# Altium schematic sheet RTM_CON.SchDoc: Sayma RTM
size 420 x 297 mm; Author: G.Kasprowicz; CompanyName: WUT ISE; DrawnBy: G.Kasprowicz; Organization: WUT ISE; Address1: PW ISE; Address2: Nowowiejska 15/19 00-665 Warsaw; Address3: gkasprow@gmail.com; DocumentNumber: 2; Revision: 1.0; SheetNumber: 2; SheetTotal: 18; ModifiedBy: -; CheckedDate: -; Title2: RTM connector; DivGrp: WUT ISE; Designer: G.Kasprowicz; ModifiedDate: -; ProjectName: Sensor Box
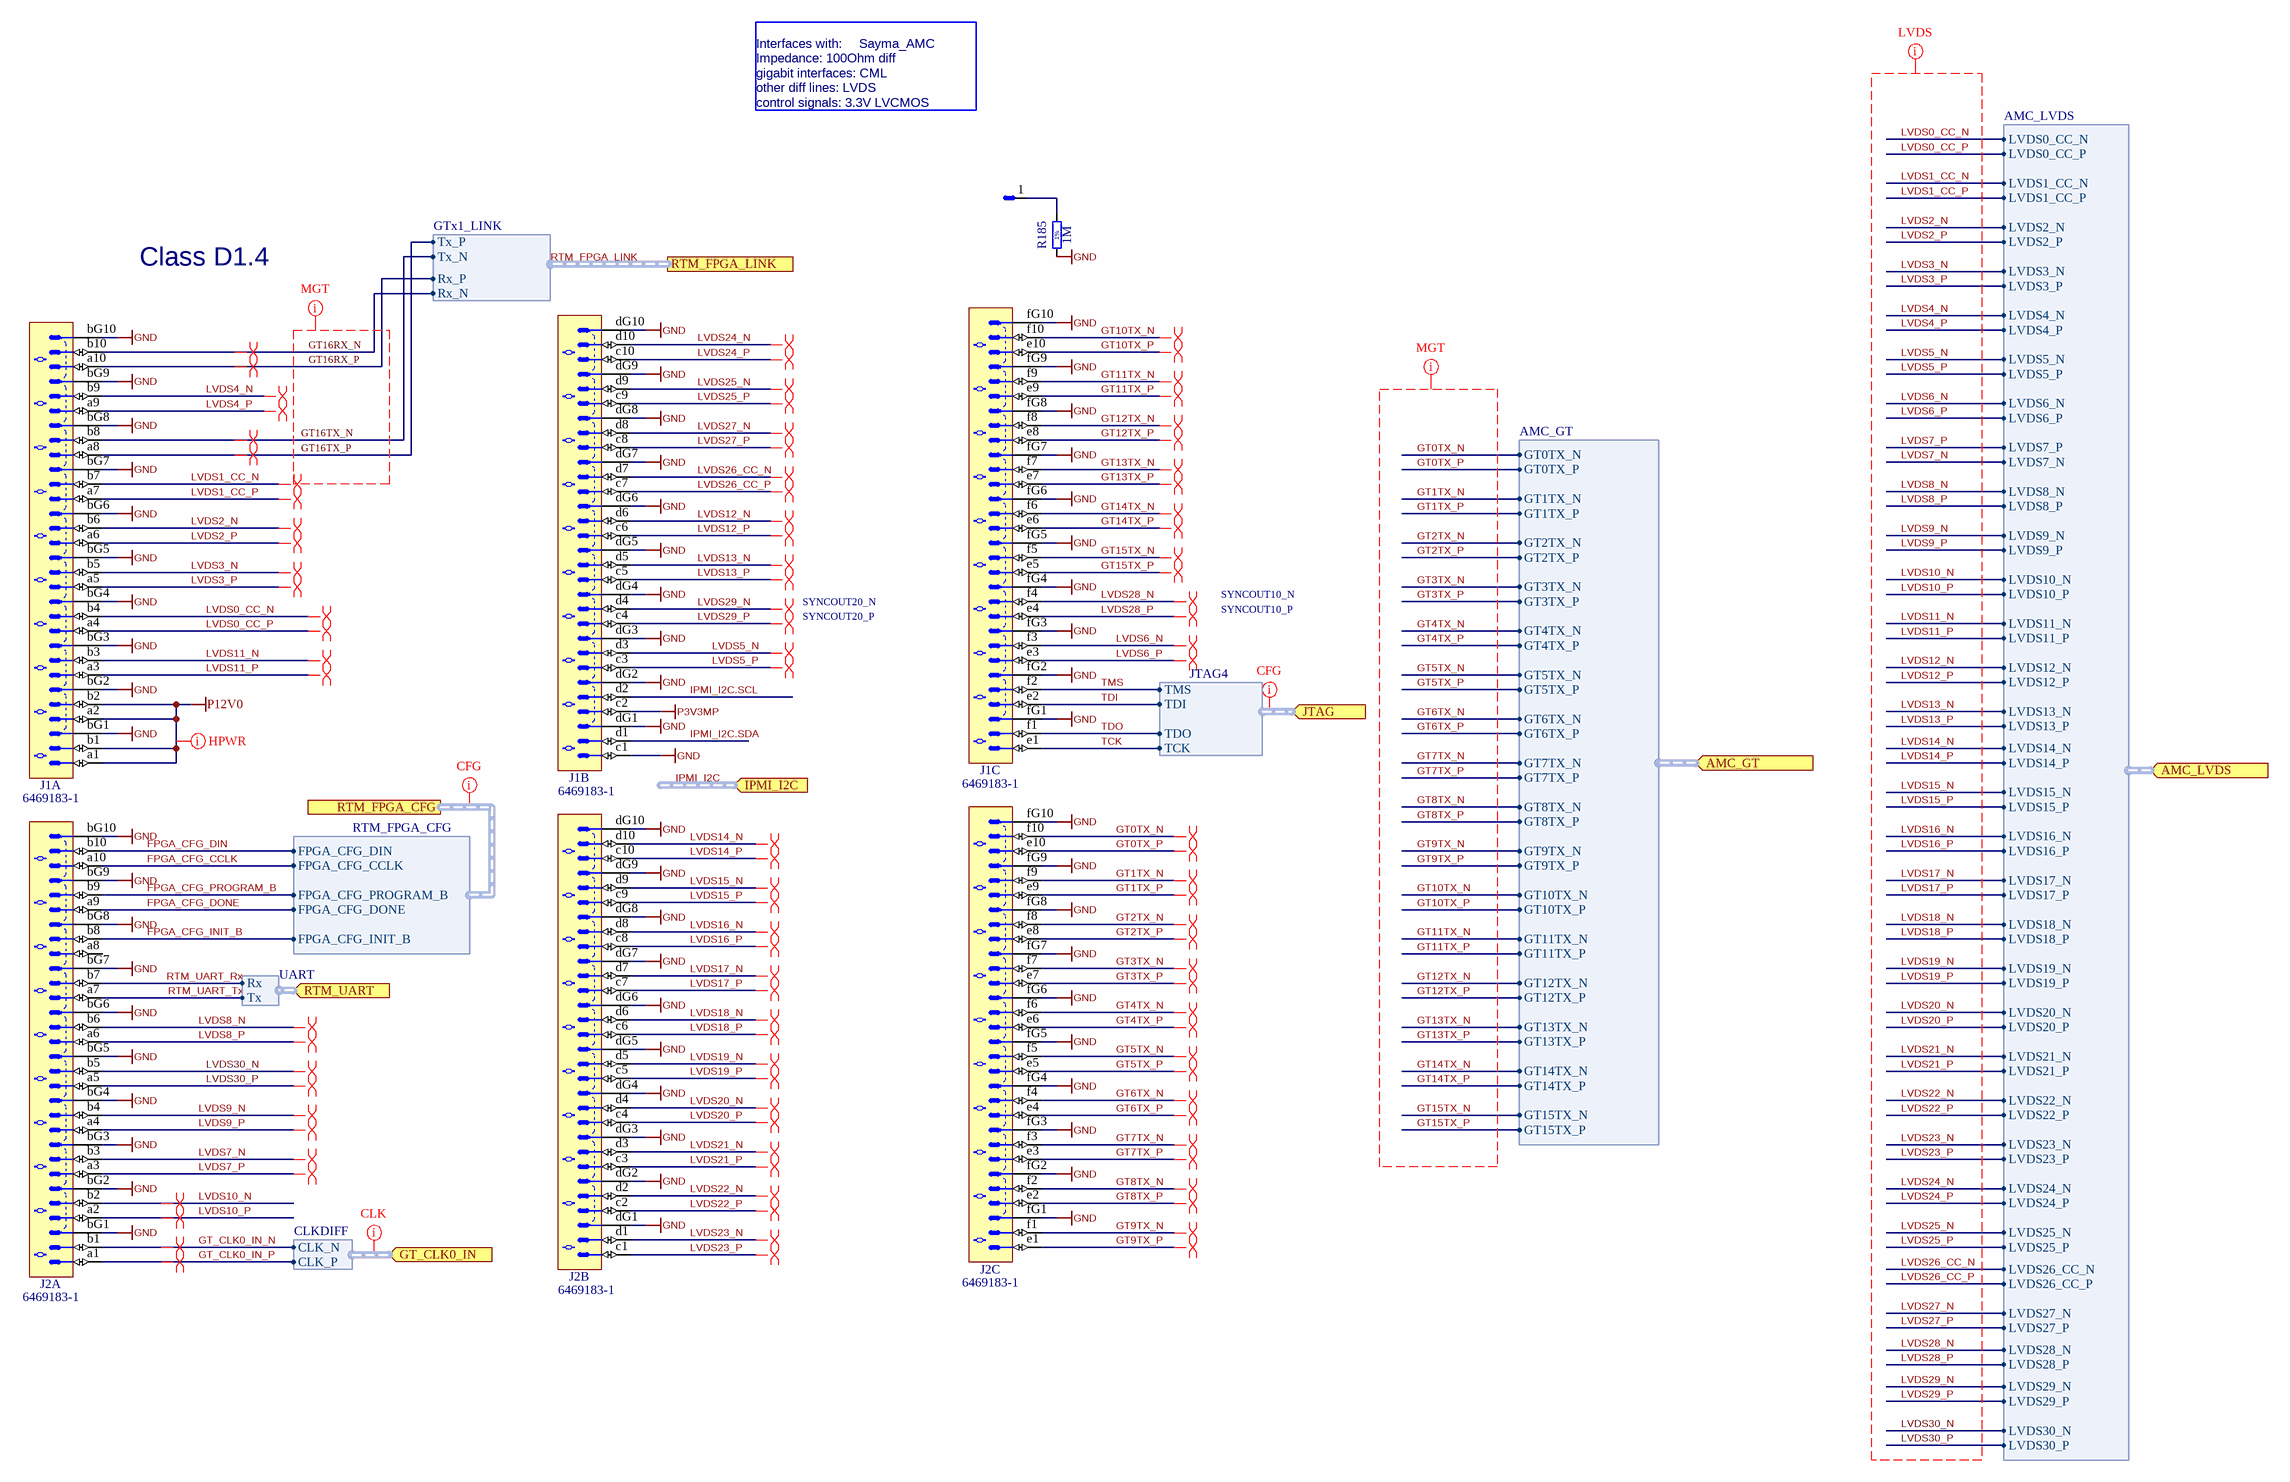
[diagram p0: RTM_CON.SchDoc]

## Parts
J1  Manufacturer Part Number: 6469183-1  [TYCO_6469183-1]  (hidden comment: Advanced TCA)  (parts A,B,C of 3)
J2  Manufacturer Part Number: 6469183-1  [TYCO_6469183-1]  (hidden comment: Advanced TCA)  (parts A,B,C of 3)
J3  (no value)  [TYCO_1469265-1]
R185  1M  [RESC5025X65N]

## Ports
AMC_GT (in, harness AMC_GT), AMC_LVDS (in, harness AMC_LVDS), GT_CLK0_IN (in, harness CLKDIFF), IPMI_I2C (in, harness I2C), JTAG (in, harness JTAG4), RTM_FPGA_CFG (harness RTM_FPGA_CFG), RTM_FPGA_LINK (harness GTx1_LINK), RTM_UART (in, harness UART)

## Harnesses
UART: Rx, Tx
JTAG4: TCK, TDI, TDO, TMS
RTM_FPGA_CFG: FPGA_CFG_DIN, FPGA_CFG_CCLK, FPGA_CFG_PROGRAM_B, FPGA_CFG_DONE, FPGA_CFG_INIT_B
GTx1_LINK: Tx_P, Tx_N, Rx_P, Rx_N
AMC_LVDS: LVDS0_CC_N, LVDS0_CC_P, LVDS1_CC_N, LVDS1_CC_P, LVDS2_N, LVDS2_P, LVDS3_N, LVDS3_P, LVDS4_N, LVDS4_P, LVDS5_N, LVDS5_P, LVDS6_N, LVDS7_P, LVDS6_P, LVDS7_N, LVDS8_N, LVDS8_P, LVDS9_N, LVDS9_P, LVDS10_N, LVDS10_P, LVDS11_N, LVDS11_P, LVDS12_N, LVDS12_P, LVDS13_N, LVDS13_P, LVDS14_N, LVDS14_P, LVDS15_N, LVDS15_P, LVDS16_N, LVDS16_P, LVDS17_N, LVDS17_P, LVDS18_N, LVDS18_P, LVDS19_N, LVDS19_P, LVDS20_N, LVDS20_P, LVDS21_N, LVDS21_P, LVDS22_N, LVDS22_P, LVDS23_N, LVDS23_P, LVDS24_N, LVDS24_P, LVDS25_N, LVDS25_P, LVDS26_CC_N, LVDS26_CC_P, LVDS27_N, LVDS27_P, LVDS28_N, LVDS28_P, LVDS29_N, LVDS29_P, LVDS30_N, LVDS30_P
AMC_GT: GT0TX_N, GT0TX_P, GT1TX_N, GT1TX_P, GT2TX_N, GT2TX_P, GT3TX_N, GT3TX_P, GT4TX_N, GT4TX_P, GT5TX_N, GT5TX_P, GT6TX_N, GT6TX_P, GT7TX_N, GT7TX_P, GT8TX_N, GT8TX_P, GT9TX_N, GT9TX_P, GT10TX_N, GT10TX_P, GT11TX_N, GT11TX_P, GT12TX_N, GT12TX_P, GT13TX_N, GT13TX_P, GT14TX_N, GT14TX_P, GT15TX_N, GT15TX_P
CLKDIFF: CLK_N, CLK_P

## Nets
GND: J1.bG1 J1.bG2 J1.bG3 J1.bG4 J1.bG5 J1.bG6 J1.bG7 J1.bG8 J1.bG9 J1.bG10 J1.c1 J1.dG1 J1.dG2 J1.dG3 J1.dG4 J1.dG5 J1.dG6 J1.dG7 J1.dG8 J1.dG9 J1.dG10 J1.fG1 J1.fG2 J1.fG3 J1.fG4 J1.fG5 J1.fG6 J1.fG7 J1.fG8 J1.fG9 J1.fG10 J2.bG1 J2.bG2 J2.bG3 J2.bG4 J2.bG5 J2.bG6 J2.bG7 J2.bG8 J2.bG9 J2.bG10 J2.dG1 J2.dG2 J2.dG3 J2.dG4 J2.dG5 J2.dG6 J2.dG7 J2.dG8 J2.dG9 J2.dG10 J2.fG1 J2.fG2 J2.fG3 J2.fG4 J2.fG5 J2.fG6 J2.fG7 J2.fG8 J2.fG9 J2.fG10 R185.1
P3V3MP: J1.c2
P12V0: J1.a1 J1.a2 J1.b1 J1.b2
FPGA_CFG_CCLK: J2.a10 ; port RTM_FPGA_CFG.FPGA_CFG_CCLK
FPGA_CFG_DIN: J2.b10 ; port RTM_FPGA_CFG.FPGA_CFG_DIN
FPGA_CFG_DONE: J2.a9 ; port RTM_FPGA_CFG.FPGA_CFG_DONE
FPGA_CFG_INIT_B: J2.b8 ; port RTM_FPGA_CFG.FPGA_CFG_INIT_B
FPGA_CFG_PROGRAM_B: J2.b9 ; port RTM_FPGA_CFG.FPGA_CFG_PROGRAM_B
GT0TX_N: J2.f10 ; port AMC_GT.GT0TX_N
GT0TX_P: J2.e10 ; port AMC_GT.GT0TX_P
GT1TX_N: J2.f9 ; port AMC_GT.GT1TX_N
GT1TX_P: J2.e9 ; port AMC_GT.GT1TX_P
GT2TX_N: J2.f8 ; port AMC_GT.GT2TX_N
GT2TX_P: J2.e8 ; port AMC_GT.GT2TX_P
GT3TX_N: J2.f7 ; port AMC_GT.GT3TX_N
GT3TX_P: J2.e7 ; port AMC_GT.GT3TX_P
GT4TX_N: J2.f6 ; port AMC_GT.GT4TX_N
GT4TX_P: J2.e6 ; port AMC_GT.GT4TX_P
GT5TX_N: J2.f5 ; port AMC_GT.GT5TX_N
GT5TX_P: J2.e5 ; port AMC_GT.GT5TX_P
GT6TX_N: J2.f4 ; port AMC_GT.GT6TX_N
GT6TX_P: J2.e4 ; port AMC_GT.GT6TX_P
GT7TX_N: J2.f3 ; port AMC_GT.GT7TX_N
GT7TX_P: J2.e3 ; port AMC_GT.GT7TX_P
GT8TX_N: J2.f2 ; port AMC_GT.GT8TX_N
GT8TX_P: J2.e2 ; port AMC_GT.GT8TX_P
GT9TX_N: J2.f1 ; port AMC_GT.GT9TX_N
GT9TX_P: J2.e1 ; port AMC_GT.GT9TX_P
GT10TX_N: J1.f10 ; port AMC_GT.GT10TX_N
GT10TX_P: J1.e10 ; port AMC_GT.GT10TX_P
GT11TX_N: J1.f9 ; port AMC_GT.GT11TX_N
GT11TX_P: J1.e9 ; port AMC_GT.GT11TX_P
GT12TX_N: J1.f8 ; port AMC_GT.GT12TX_N
GT12TX_P: J1.e8 ; port AMC_GT.GT12TX_P
GT13TX_N: J1.f7 ; port AMC_GT.GT13TX_N
GT13TX_P: J1.e7 ; port AMC_GT.GT13TX_P
GT14TX_N: J1.f6 ; port AMC_GT.GT14TX_N
GT14TX_P: J1.e6 ; port AMC_GT.GT14TX_P
GT15TX_N: J1.f5 ; port AMC_GT.GT15TX_N
GT15TX_P: J1.e5 ; port AMC_GT.GT15TX_P
GT16RX_N: J1.b10 ; port RTM_FPGA_LINK.Rx_N
GT16RX_P: J1.a10 ; port RTM_FPGA_LINK.Rx_P
GT16TX_N: J1.b8 ; port RTM_FPGA_LINK.Tx_N
GT16TX_P: J1.a8 ; port RTM_FPGA_LINK.Tx_P
GT_CLK0_IN_N: J2.b1 ; port GT_CLK0_IN.CLK_N
GT_CLK0_IN_P: J2.a1 ; port GT_CLK0_IN.CLK_P
IPMI_I2C.SCL: J1.d2
IPMI_I2C.SDA: J1.d1
LVDS0_CC_N: J1.b4 ; port AMC_LVDS.LVDS0_CC_N
LVDS0_CC_P: J1.a4 ; port AMC_LVDS.LVDS0_CC_P
LVDS1_CC_N: J1.b7 ; port AMC_LVDS.LVDS1_CC_N
LVDS1_CC_P: J1.a7 ; port AMC_LVDS.LVDS1_CC_P
LVDS2_N: J1.b6 ; port AMC_LVDS.LVDS2_N
LVDS2_P: J1.a6 ; port AMC_LVDS.LVDS2_P
LVDS3_N: J1.b5 ; port AMC_LVDS.LVDS3_N
LVDS3_P: J1.a5 ; port AMC_LVDS.LVDS3_P
LVDS4_N: J1.b9 ; port AMC_LVDS.LVDS4_N
LVDS4_P: J1.a9 ; port AMC_LVDS.LVDS4_P
LVDS5_N: J1.d3 ; port AMC_LVDS.LVDS5_N
LVDS5_P: J1.c3 ; port AMC_LVDS.LVDS5_P
LVDS6_N: J1.f3 ; port AMC_LVDS.LVDS6_N
LVDS6_P: J1.e3 ; port AMC_LVDS.LVDS6_P
LVDS7_N: J2.b3 ; port AMC_LVDS.LVDS7_N
LVDS7_P: J2.a3 ; port AMC_LVDS.LVDS7_P
LVDS8_N: J2.b6 ; port AMC_LVDS.LVDS8_N
LVDS8_P: J2.a6 ; port AMC_LVDS.LVDS8_P
LVDS9_N: J2.b4 ; port AMC_LVDS.LVDS9_N
LVDS9_P: J2.a4 ; port AMC_LVDS.LVDS9_P
LVDS10_N: J2.b2 ; port AMC_LVDS.LVDS10_N
LVDS10_P: J2.a2 ; port AMC_LVDS.LVDS10_P
LVDS11_N: J1.b3 ; port AMC_LVDS.LVDS11_N
LVDS11_P: J1.a3 ; port AMC_LVDS.LVDS11_P
LVDS12_N: J1.d6 ; port AMC_LVDS.LVDS12_N
LVDS12_P: J1.c6 ; port AMC_LVDS.LVDS12_P
LVDS13_N: J1.d5 ; port AMC_LVDS.LVDS13_N
LVDS13_P: J1.c5 ; port AMC_LVDS.LVDS13_P
LVDS14_N: J2.d10 ; port AMC_LVDS.LVDS14_N
LVDS14_P: J2.c10 ; port AMC_LVDS.LVDS14_P
LVDS15_N: J2.d9 ; port AMC_LVDS.LVDS15_N
LVDS15_P: J2.c9 ; port AMC_LVDS.LVDS15_P
LVDS16_N: J2.d8 ; port AMC_LVDS.LVDS16_N
LVDS16_P: J2.c8 ; port AMC_LVDS.LVDS16_P
LVDS17_N: J2.d7 ; port AMC_LVDS.LVDS17_N
LVDS17_P: J2.c7 ; port AMC_LVDS.LVDS17_P
LVDS18_N: J2.d6 ; port AMC_LVDS.LVDS18_N
LVDS18_P: J2.c6 ; port AMC_LVDS.LVDS18_P
LVDS19_N: J2.d5 ; port AMC_LVDS.LVDS19_N
LVDS19_P: J2.c5 ; port AMC_LVDS.LVDS19_P
LVDS20_N: J2.d4 ; port AMC_LVDS.LVDS20_N
LVDS20_P: J2.c4 ; port AMC_LVDS.LVDS20_P
LVDS21_N: J2.d3 ; port AMC_LVDS.LVDS21_N
LVDS21_P: J2.c3 ; port AMC_LVDS.LVDS21_P
LVDS22_N: J2.d2 ; port AMC_LVDS.LVDS22_N
LVDS22_P: J2.c2 ; port AMC_LVDS.LVDS22_P
LVDS23_N: J2.d1 ; port AMC_LVDS.LVDS23_N
LVDS23_P: J2.c1 ; port AMC_LVDS.LVDS23_P
LVDS24_N: J1.d10 ; port AMC_LVDS.LVDS24_N
LVDS24_P: J1.c10 ; port AMC_LVDS.LVDS24_P
LVDS25_N: J1.d9 ; port AMC_LVDS.LVDS25_N
LVDS25_P: J1.c9 ; port AMC_LVDS.LVDS25_P
LVDS26_CC_N: J1.d7 ; port AMC_LVDS.LVDS26_CC_N
LVDS26_CC_P: J1.c7 ; port AMC_LVDS.LVDS26_CC_P
LVDS27_N: J1.d8 ; port AMC_LVDS.LVDS27_N
LVDS27_P: J1.c8 ; port AMC_LVDS.LVDS27_P
LVDS28_N: J1.f4 ; port AMC_LVDS.LVDS28_N
LVDS28_P: J1.e4 ; port AMC_LVDS.LVDS28_P
LVDS29_N: J1.d4 ; port AMC_LVDS.LVDS29_N
LVDS29_P: J1.c4 ; port AMC_LVDS.LVDS29_P
LVDS30_N: J2.b5 ; port AMC_LVDS.LVDS30_N
LVDS30_P: J2.a5 ; port AMC_LVDS.LVDS30_P
RTM_UART_Rx: J2.b7 ; port RTM_UART.Rx
RTM_UART_Tx: J2.a7 ; port RTM_UART.Tx
TCK: J1.e1 ; port JTAG.TCK
TDI: J1.e2 ; port JTAG.TDI
TDO: J1.f1 ; port JTAG.TDO
TMS: J1.f2 ; port JTAG.TMS
NetJ3_1: J3.1 R185.2

Not connected (* = marked no-connect by the designer): J2 a8

## Buses and harness runs
harness IPMI_I2C = port IPMI_I2C
harness RTM_FPGA_LINK = port RTM_FPGA_LINK

## Layout directives
net class MGT: GT0TX_N, GT0TX_P, GT1TX_N, GT1TX_P, GT2TX_N, GT2TX_P, GT3TX_N, GT3TX_P, GT4TX_N, GT4TX_P, GT5TX_N, GT5TX_P, GT6TX_N, GT6TX_P, GT7TX_N, GT7TX_P, GT8TX_N, GT8TX_P, GT9TX_N, GT9TX_P, GT10TX_N, GT10TX_P, GT11TX_N, GT11TX_P, GT12TX_N, GT12TX_P, GT13TX_N, GT13TX_P, GT14TX_N, GT14TX_P, GT15TX_N, GT15TX_P, GT16RX_N, GT16RX_P, GT16TX_N, GT16TX_P
net class LVDS: LVDS0_CC_N, LVDS0_CC_P, LVDS1_CC_N, LVDS1_CC_P, LVDS2_N, LVDS2_P, LVDS3_N, LVDS3_P, LVDS4_N, LVDS4_P, LVDS5_N, LVDS5_P, LVDS6_N, LVDS6_P, LVDS7_N, LVDS7_P, LVDS8_N, LVDS8_P, LVDS9_N, LVDS9_P, LVDS10_N, LVDS10_P, LVDS11_N, LVDS11_P, LVDS12_N, LVDS12_P, LVDS13_N, LVDS13_P, LVDS14_N, LVDS14_P, LVDS15_N, LVDS15_P, LVDS16_N, LVDS16_P, LVDS17_N, LVDS17_P, LVDS18_N, LVDS18_P, LVDS19_N, LVDS19_P, LVDS20_N, LVDS20_P, LVDS21_N, LVDS21_P, LVDS22_N, LVDS22_P, LVDS23_N, LVDS23_P, LVDS24_N, LVDS24_P, LVDS25_N, LVDS25_P, LVDS26_CC_N, LVDS26_CC_P, LVDS27_N, LVDS27_P, LVDS28_N, LVDS28_P, LVDS29_N, LVDS29_P, LVDS30_N, LVDS30_P
net class CLK: (no net found under the mark)
differential pair: GT0TX_N, GT0TX_P, GT1TX_N, GT1TX_P, GT2TX_N, GT2TX_P, GT3TX_N, GT3TX_P, GT4TX_N, GT4TX_P, GT5TX_N, GT5TX_P, GT6TX_N, GT6TX_P, GT7TX_N, GT7TX_P, GT8TX_N, GT8TX_P, GT9TX_N, GT9TX_P, GT10TX_N, GT10TX_P, GT11TX_N, GT11TX_P, GT12TX_N, GT12TX_P, GT13TX_N, GT13TX_P, GT14TX_N, GT14TX_P, GT15TX_N, GT15TX_P, GT16RX_N, GT16RX_P, GT16TX_N, GT16TX_P, GT_CLK0_IN_N, GT_CLK0_IN_P, LVDS0_CC_N, LVDS0_CC_P, LVDS1_CC_N, LVDS1_CC_P, LVDS2_N, LVDS2_P, LVDS3_N, LVDS3_P, LVDS4_N, LVDS4_P, LVDS5_N, LVDS5_P, LVDS6_N, LVDS6_P, LVDS7_N, LVDS7_P, LVDS8_N, LVDS8_P, LVDS9_N, LVDS9_P, LVDS10_N, LVDS10_P, LVDS11_N, LVDS11_P, LVDS12_N, LVDS12_P, LVDS13_N, LVDS13_P, LVDS14_N, LVDS14_P, LVDS15_N, LVDS15_P, LVDS16_N, LVDS16_P, LVDS17_N, LVDS17_P, LVDS18_N, LVDS18_P, LVDS19_N, LVDS19_P, LVDS20_N, LVDS20_P, LVDS21_N, LVDS21_P, LVDS22_N, LVDS22_P, LVDS23_N, LVDS23_P, LVDS24_N, LVDS24_P, LVDS25_N, LVDS25_P, LVDS26_CC_N, LVDS26_CC_P, LVDS27_N, LVDS27_P, LVDS28_N, LVDS28_P, LVDS29_N, LVDS29_P, LVDS30_N, LVDS30_P
net class CFG: (no net found under the mark)
net class HPWR: P12V0

## Notes on the sheet
- gigabit interfaces: CML
- Impedance: 100Ohm diff
- other diff lines: LVDS
- Interfaces with:
- control signals: 3.3V LVCMOS
- Sayma_AMC
- Class D1.4
- SYNCOUT20_N
- SYNCOUT10_N
- SYNCOUT20_P
- SYNCOUT10_P
- Project/Equipment
- Document
- Designer
- Drawn by
- Check.by
- Copyright WUT ISE 2018.
  This documentation describes Open Hardware and is licensed under the CERN OHL v.1.1. You may redistribute and modify this documentation under the terms of the CERN OHL v.1.1. (http://ohwr.org/CERNOHL). This documentation is distributed WITHOUT ANY EXPRESS OR IMPLIED WARRANTY, INCLUDING OF MERCHANTABILITY, SATISFACTORY QUALITY AND FITNESS FOR A PARTICULAR PURPOSE. Please see the CERN OHL v.1.1 for applicable conditions.
- Contact
- File
- Last Mod.
- Print Date
- Sheet
- Size
- A3
- of
- Rev
- (in symbol R2010_1M_1%_0.5W_200PPM) 1%

## Library data of the parts
J1 J2 = TYCO_6469183-1: Connector 60 ATCA Male 30 Pairs (60 Signals) + 3x10 Ground; Manufacturer: TYCO ELECTRONICS; Part Description: 60 Positions, Pitch 2.5mm,  Advanced TCA, Z-PACK HM-Zd Right Angle Press Fit Header; Author: CERN DEM JLC; Component Kind: Standard; Component Type: Standard; ComponentHeight: 13.31mm; CreateDate: 28.08.2013; Family: Advanced TCA; HelpURL: \\cern.ch\dfs\Applications\Altium\Datasheets\TYCO_6469183-1.pdf; LatestRevisionDate: 28.08.2013; Mounted: Yes; Part Number: TYCO_6469183-1; Pin Count: 90; PressFit: Yes; Sense: No; SMD: No; Socket: No; Status: None
J3 = TYCO_1469265-1: Single Pin Male; Manufacturer: TYCO ELECTRONICS; Part Description: Universal Right Angle Male Power Module Guide (keyed); PressFit: No; Author: CERN DEM JLC; Component Kind: Standard; Component Type: Standard; ComponentHeight: 9.78mm; CreateDate: 28.08.2013; HelpURL: \\cern.ch\dfs\Applications\Altium\Datasheets\TYCO_1469265-1.pdf; LatestRevisionDate: 28.08.2013; Manufacturer Part Number: 1469265-1; Mounted: Yes; Part Number: TYCO_1469265-1; Pin Count: 1; Sense: No; SMD: No; Socket: No; Status: None
R185 = R2010_1M_1%_0.5W_200PPM: Resistor - 1%; Manufacturer: GENERIC; Manufacturer1 Part Number: LHVC2010-1MFT4; Part Description: Thick Film Chip Resistor; Power: 0.5W; TC: ±200ppm/°C; PressFit: No; Case: 2010; Manufacturer Part Number: R2010_1M_1%_0.5W_200PPM; Manufacturer1 ComponentHeight: 0.65mm; Manufacturer1 Example: TT WELWYN; Part Number: R2010_1M_1%_0.5W_200PPM; Pin Count: 2; Sense: No; SMD: Yes; Status: None; Tolerance: ±1%; Value: 1M; Component Kind: Standard; Component Type: Standard; Mounted: Yes; Socket: No; HelpURL: \\cern.ch\dfs\Applications\Altium\Datasheets\R2010_WELWYN_LHVC.pdf; Author: CERN DEM JLC; CreateDate: 26.02.2015; LatestRevisionDate: 26.02.2015